# Altium project Blackbox+Remote.PrjPcb
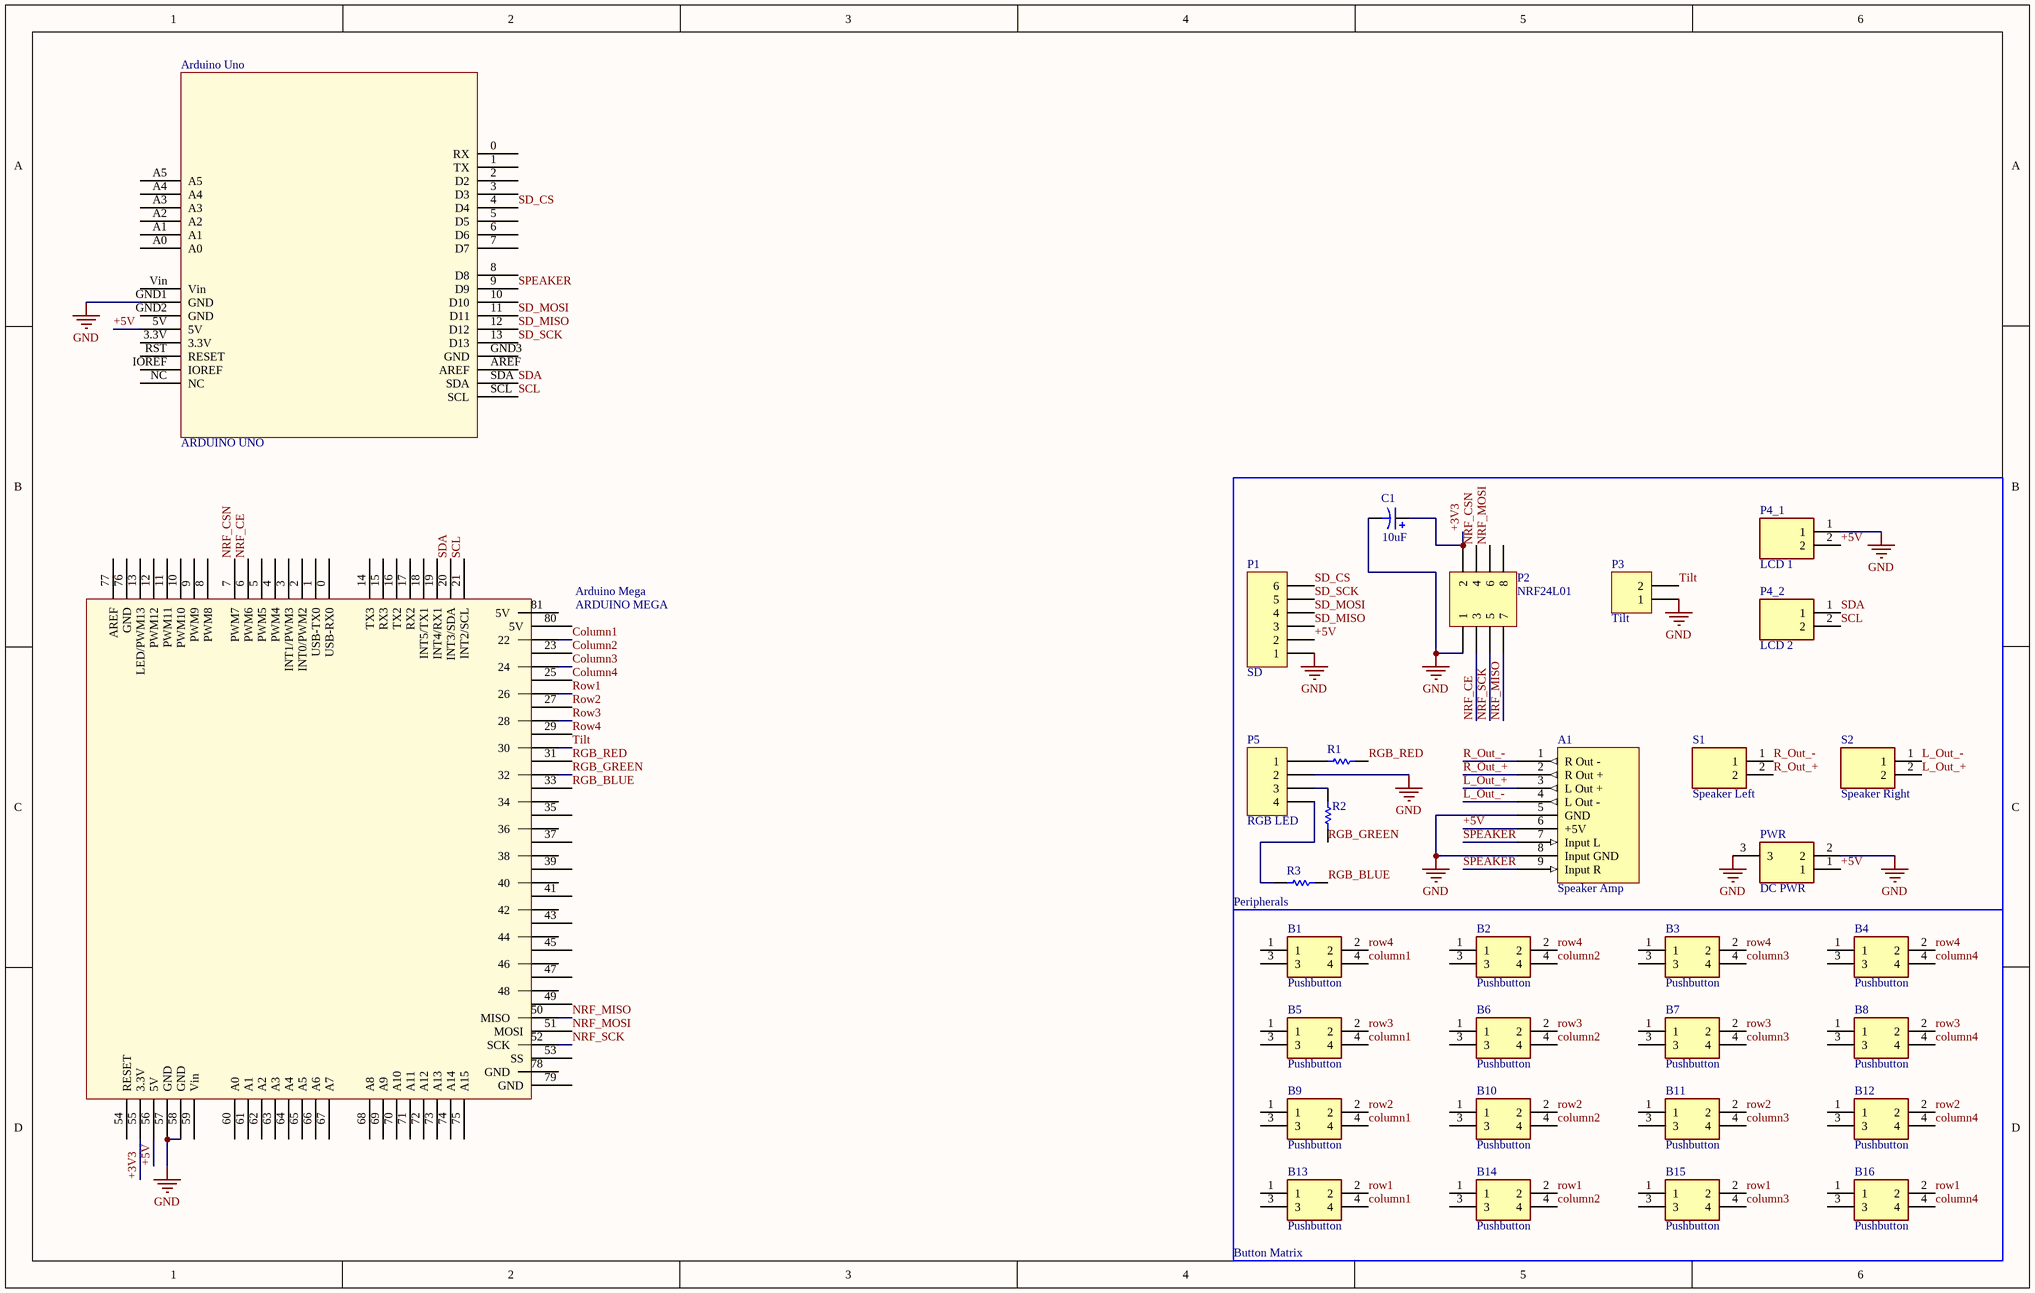
[diagram p0: main.SchDoc]
1 sheet, 32 parts. Net scope: global (net labels, ports and power ports of the same name join across sheets).
Board file: main.PcbDoc

## Sheet main.SchDoc
size B; SheetNumber: 1; SheetTotal: 1

### Parts
A1  Speaker Amp  [HiLetgo PAM8403 Amp Module]
Arduino_Mega  ARDUINO MEGA  [ARDUINO MEGA]
Arduino_Uno  ARDUINO UNO  [ARDUINO UNO]
B1  Pushbutton  [FSM4JH]
B2  Pushbutton  [FSM4JH]
B3  Pushbutton  [FSM4JH]
B4  Pushbutton  [FSM4JH]
B5  Pushbutton  [FSM4JH]
B6  Pushbutton  [FSM4JH]
B7  Pushbutton  [FSM4JH]
B8  Pushbutton  [FSM4JH]
B9  Pushbutton  [FSM4JH]
B10  Pushbutton  [FSM4JH]
B11  Pushbutton  [FSM4JH]
B12  Pushbutton  [FSM4JH]
B13  Pushbutton  [FSM4JH]
B14  Pushbutton  [FSM4JH]
B15  Pushbutton  [FSM4JH]
B16  Pushbutton  [FSM4JH]
C1  value 10uF  [RB7.6-15]
P1  SD  [HDR1X6]
P2  NRF24L01  [HDR2X4]
P3  Tilt  [HDR1X2]
P4_1  LCD 1  [TB00250002BE]
P4_2  LCD 2  [TB00250002BE]
P5  RGB LED  [HDR1X4]
PWR  DC PWR  [PJ-102AH]
R1  (no value)  [AXIAL-0.3]
R2  (no value)  [AXIAL-0.3]
R3  (no value)  [AXIAL-0.3]
S1  Speaker Left  [TB00250002BE]
S2  Speaker Right  [TB00250002BE]

### Blocks framed on the sheet
Peripherals: A1 C1 P1-P3 P4_1 P4_2 P5 PWR R1-R3 S1 S2

### Nets
GND: A1.5(GND) A1.8(Input_GND) Arduino_Mega.57(GND) Arduino_Mega.58(GND) Arduino_Uno.GND1(GND) C1.2 P1.1 P2.1 P3.1 P4_1.1 P5.2 PWR.2 PWR.3
+3V3: Arduino_Mega.55(3.3V) C1.1 P2.2
+5V: A1.6(+5V) Arduino_Mega.56(5V) Arduino_Uno.5V P1.2 P4_1.2 PWR.1
column1: Arduino_Mega.22 B1.4 B5.4 B9.4 B13.4
column2: Arduino_Mega.23 B2.4 B6.4 B10.4 B14.4
column3: Arduino_Mega.24 B3.4 B7.4 B11.4 B15.4
column4: Arduino_Mega.25 B4.4 B8.4 B12.4 B16.4
L_Out_+: A1.3(L_Out_+) S2.2
L_Out_-: A1.4(L_Out_-) S2.1
NRF_CE: Arduino_Mega.6(PWM6) P2.3
NRF_CSN: Arduino_Mega.7(PWM7) P2.4
NRF_MISO: Arduino_Mega.50(MISO) P2.7
NRF_MOSI: Arduino_Mega.51(MOSI) P2.6
NRF_SCK: Arduino_Mega.52(SCK) P2.5
R_Out_+: A1.2(R_Out_+) S1.2
R_Out_-: A1.1(R_Out_-) S1.1
RGB_BLUE: Arduino_Mega.33 R3.2
RGB_GREEN: Arduino_Mega.32 R2.1
RGB_RED: Arduino_Mega.31 R1.2
row1: Arduino_Mega.26 B13.2 B14.2 B15.2 B16.2
row2: Arduino_Mega.27 B9.2 B10.2 B11.2 B12.2
row3: Arduino_Mega.28 B5.2 B6.2 B7.2 B8.2
row4: Arduino_Mega.29 B1.2 B2.2 B3.2 B4.2
SCL: Arduino_Mega.21(INT2/SCL) Arduino_Uno.SCL P4_2.2
SD_CS: Arduino_Uno.4(D4) P1.6
SD_MISO: Arduino_Uno.12(D12) P1.3
SD_MOSI: Arduino_Uno.11(D11) P1.4
SD_SCK: Arduino_Uno.13(D13) P1.5
SDA: Arduino_Mega.20(INT3/SDA) Arduino_Uno.SDA P4_2.1
SPEAKER: A1.7(Input_L) A1.9(Input_R) Arduino_Uno.9(D9)
Tilt: Arduino_Mega.30 P3.2
NetP5_1: P5.1 R1.1
NetP5_3: P5.3 R2.2
NetP5_4: P5.4 R3.1

Not connected (* = marked no-connect by the designer): Arduino_Mega 0(USB-RX0) 1(USB-TX0) 2(INT0/PWM2) 3(INT1/PWM3) 4(PWM4) 5(PWM5) 8(PWM8) 9(PWM9) 10(PWM10) 11(PWM11) 12(PWM12) 13(LED/PWM13) 14(TX3) 15(RX3) 16(TX2) 17(RX2) 18(INT5/TX1) 19(INT4/RX1) 34 35 36 37 38 39 40 41 42 43 44 45 46 47 48 49 53(SS) 54(RESET) 59(Vin) 60(A0) 61(A1) 62(A2) 63(A3) 64(A4) 65(A5) 66(A6) 67(A7) 68(A8) 69(A9) 70(A10) 71(A11) 72(A12) 73(A13) 74(A14) 75(A15) 76(GND) 77(AREF) 78(GND) 79(GND) 80(5V) 81(5V); Arduino_Uno 0(RX) 1(TX) 2(D2) 3(D3) 3.3V 5(D5) 6(D6) 7(D7) 8(D8) 10(D10) A0 A1 A2 A3 A4 A5 AREF GND2(GND) GND3(GND) IOREF NC RST(RESET) Vin; B1 1 3; B2 1 3; B3 1 3; B4 1 3; B5 1 3; B6 1 3; B7 1 3; B8 1 3; B9 1 3; B10 1 3; B11 1 3; B12 1 3; B13 1 3; B14 1 3; B15 1 3; B16 1 3; P2 8

### Notes on the sheet
- (near B13) Button Matrix

### Library data of the parts
A1 = HiLetgo PAM8403 Module: https://www.amazon.com/dp/B01DKAI51M?psc=1&smid=A30QSGOJR8LMXA&ref_=chk_typ_imgToDp
B1-B16 = FSM2JAH: Tactile Pushbutton; Manufacturer_Name: TE Connectivity; Datasheet Link: http://www.te.com/commerce/DocumentDelivery/DDEController?Action=showdoc&DocId=Customer+Drawing%7F1825910%7FC9%7Fpdf%7FEnglish%7FENG_CD_1825910_C9.pdf%7F1825910-3; Manufacturer_Part_Number: FSM2JAH; Mouser Part Number: 506-FSM2JAH; Mouser Price/Stock: https://www.mouser.co.uk/ProductDetail/TE-Connectivity-PB/FSM2JAH?qs=Of7OaoM7rsH02ckr%252BGLHNA%3D%3D
C1 = Cap Pol1: Polarized Capacitor (Radial); Published: 8-Jun-2000; LatestRevisionDate: 17-Jul-2002; LatestRevisionNote: Re-released for DXP Platform.; PackageReference: RB7.6-15; Publisher: Altium Limited; PackageDescription: Polarized Capacitor (Radial); 2 Leads
P1 = Header 6: Header, 6-Pin; LatestRevisionDate: 17-Jul-2002; LatestRevisionNote: Re-released for DXP Platform.; Publisher: Altium Limited
P2 = Header 4X2: Header, 4-Pin, Dual row; LatestRevisionDate: 17-Jul-2002; LatestRevisionNote: Re-released for DXP Platform.; Publisher: Altium Limited
P3 = Header 2: Header, 2-Pin; LatestRevisionDate: 17-Jul-2002; LatestRevisionNote: Re-released for DXP Platform.; Publisher: Altium Limited
P4_1 P4_2 S1 S2 = TB002-500-02BE: Connector; Manufacturer_Name: CUI Devices; Datasheet Link: https://eu.mouser.com/datasheet/2/670/tb002_500-1550579.pdf; Height: 10.4mm; Manufacturer_Part_Number: TB002-500-02BE; Mouser Part Number: 490-TB002-500-02BE; Mouser Price/Stock: https://www.mouser.co.uk/ProductDetail/CUI-Devices/TB002-500-02BE?qs=vLWxofP3U2x9716kcgva%2Fw%3D%3D; Arrow Part Number: TB002-500-02BE; Arrow Price/Stock: https://www.arrow.com/en/products/tb002-500-02be/cui-devices?region=nac
P5 = Header 4: Header, 4-Pin; LatestRevisionDate: 17-Jul-2002; LatestRevisionNote: Re-released for DXP Platform.; Publisher: Altium Limited
PWR = PJ-102A: DC Power Plug; Manufacturer_Name: CUI Devices; Datasheet Link: https://www.cui.com/product/resource/pj-102a.pdf; Manufacturer_Part_Number: PJ-102A; Mouser Part Number: 490-PJ-102A; Mouser Price/Stock: https://www.mouser.co.uk/ProductDetail/CUI-Devices/PJ-102A?qs=WyjlAZoYn50UKjtnxOz%252Bqg%3D%3D; Arrow Part Number: PJ-102A; Arrow Price/Stock: https://www.arrow.com/en/products/pj-102a/cui-devices?region=nac
R1-R3 = Res1: 230ohm; Value: 230; Published: 8-Jun-2000; LatestRevisionDate: 17-Jul-2002; LatestRevisionNote: Re-released for DXP Platform.; PackageReference: AXIAL-0.3; Publisher: Altium Limited; PackageDescription: Axial Device, Thru-Hole; 2 Leads; 0.3 in Pin Spacing